# Altium project DemetrioGurgel - PCEIoT.PrjPcb (part 1 of 2)
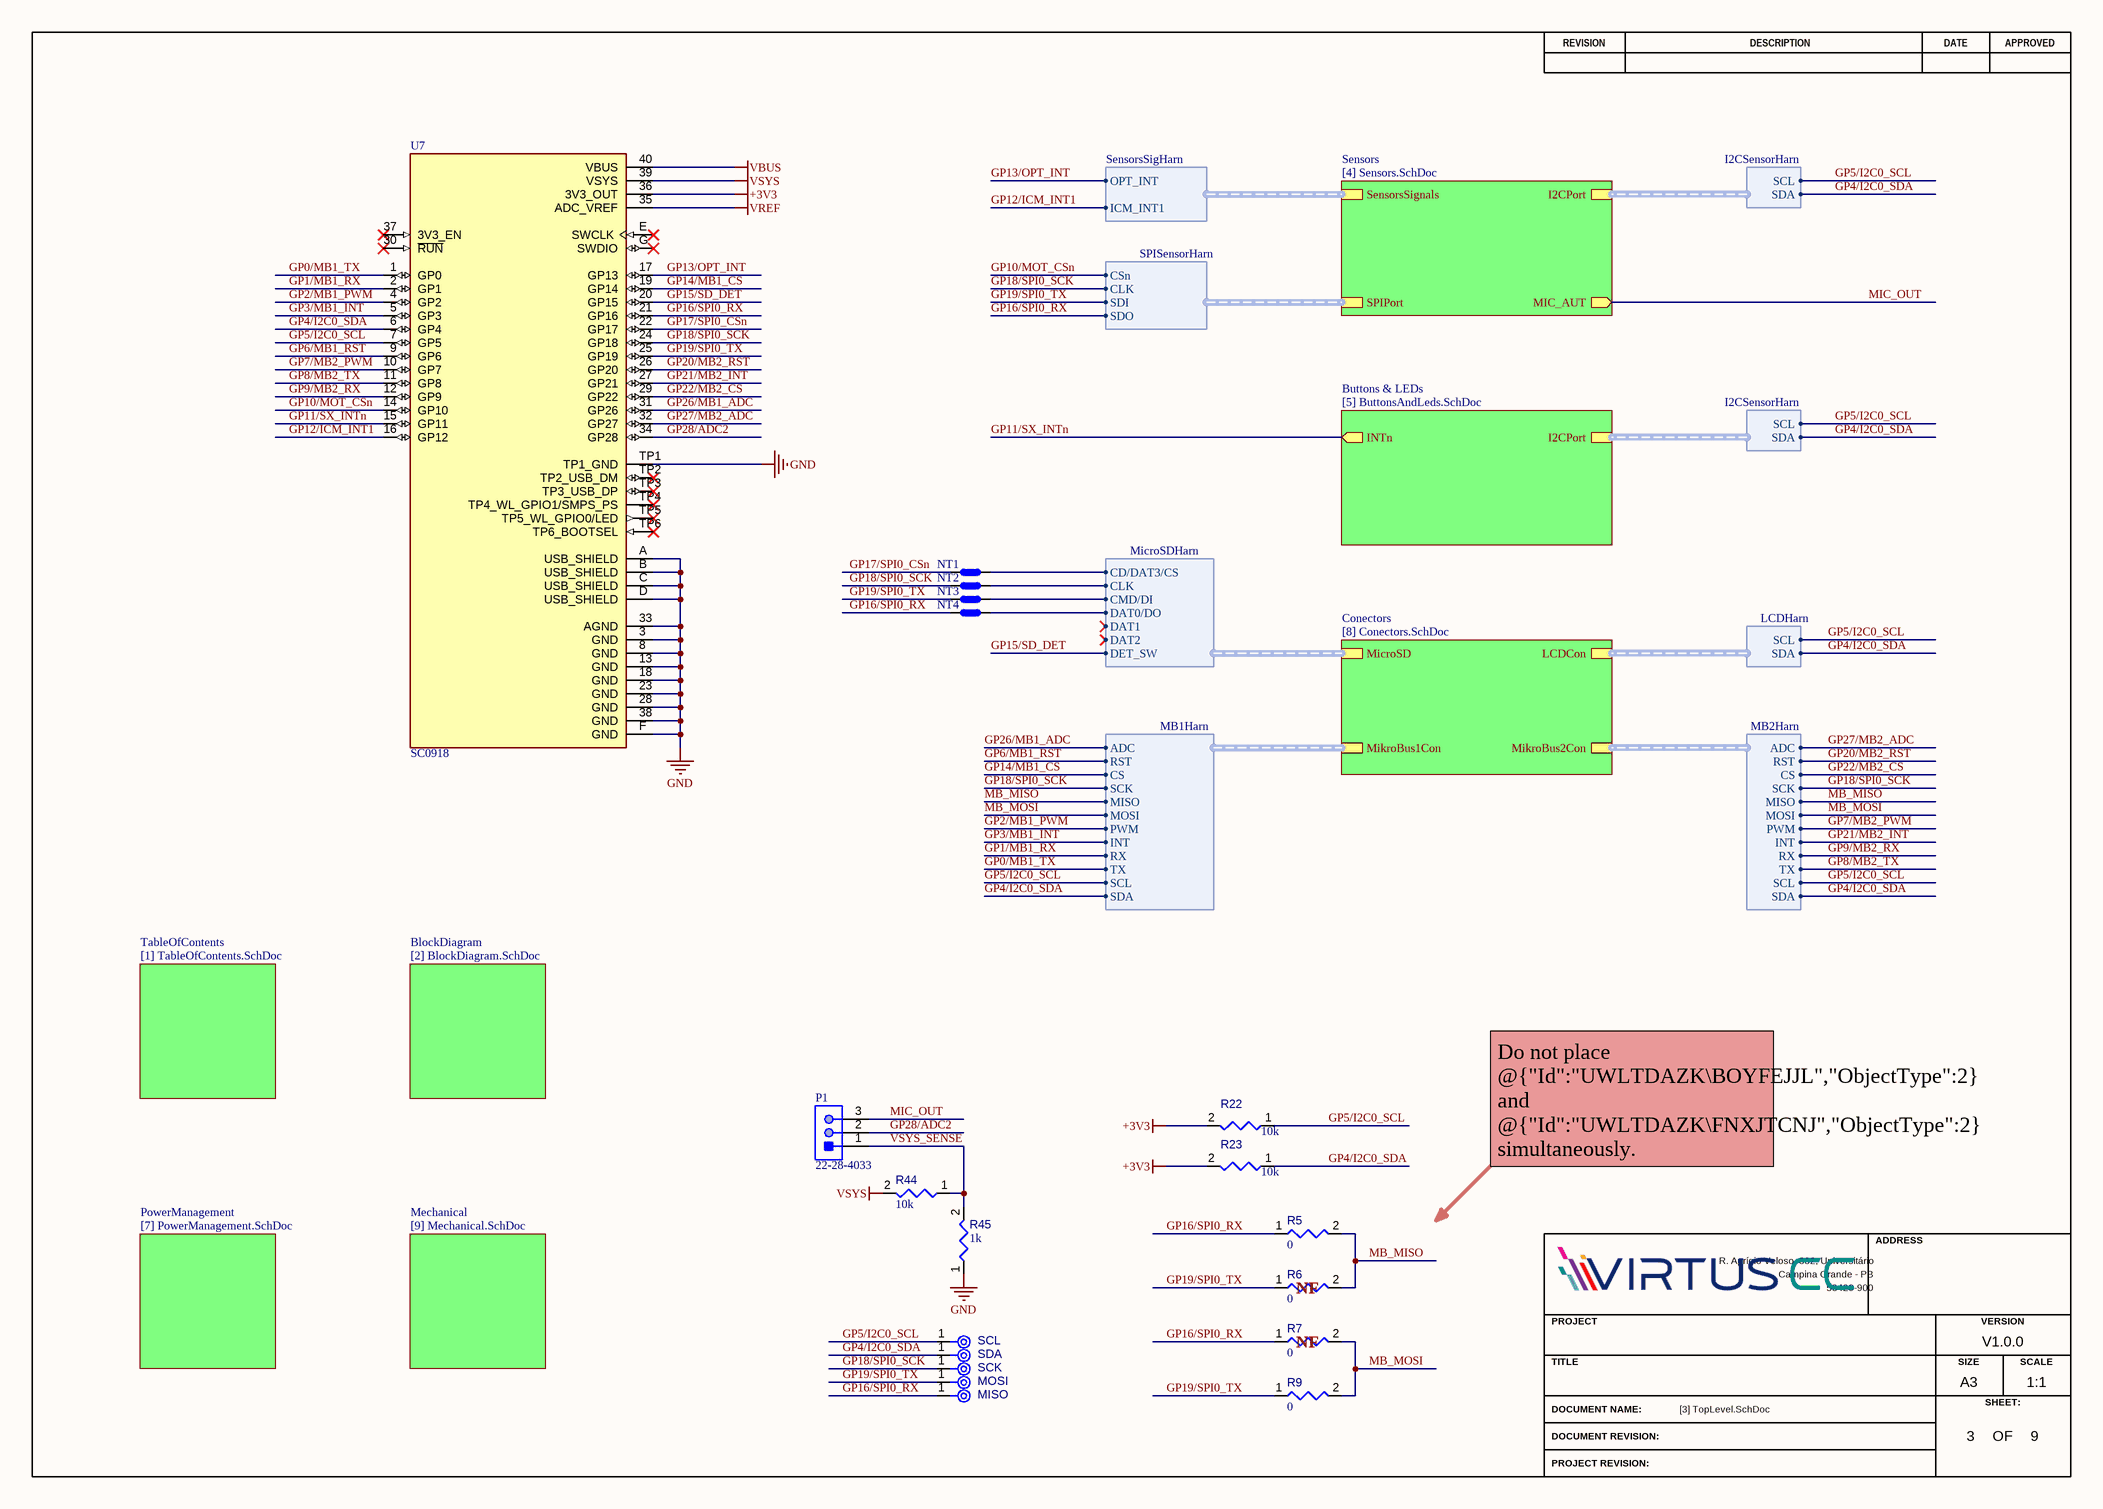
[diagram p0: [3] TopLevel.SchDoc]
Version: V1.0.0
9 sheets, 171 parts. Net scope: hierarchical (ports join the sheet entries above them; power ports are global).
Board file: DemetrioGurgel - PCEIoT.PcbDoc
Sheets:
  [3] TopLevel.SchDoc
    Buttons & LEDs = [5] ButtonsAndLeds.SchDoc
      "RGB_LEDs"1 = [6] RgbLed.SchDoc
      "RGB_LEDs"2 = [6] RgbLed.SchDoc
      "RGB_LEDs"3 = [6] RgbLed.SchDoc
    Conectors = [8] Conectors.SchDoc
    Sensors = [4] Sensors.SchDoc
    PowerManagement = [7] PowerManagement.SchDoc
    Mechanical = [9] Mechanical.SchDoc
    BlockDiagram = [2] BlockDiagram.SchDoc
    TableOfContents = [1] TableOfContents.SchDoc

## Sheet [3] TopLevel.SchDoc: =DocumentName
size A3; ENG_APP_DATE: --/--/--; DSN_APP_DATE: --/--/--; CHK_APP_DATE: --/--/--; Organization: ORGANIZATION; Address1: R. Aprígio Veloso, 882, Universitário; Address2: Campina Grande - PB; Address3: 58429-900; DocumentNumber: 3; Revision: -; SheetNumber: 3; SheetTotal: 9; Project: DemetrioGurgel - PCEIoT.PrjPcb; ENG_DATE: --/--/--; DSN_DATE: --/--/--; CHK_DATE: --/--/--; SCH_SCALE: 1:1

### Parts
MISO  TPAD6R  [TP06R]  (value not drawn)  (no BOM)
MOSI  TPAD6R  [TP06R]  (value not drawn)  (no BOM)
NT1  Net Tie  [New footprint 1]  (value not drawn)  (net tie, no BOM)
NT2  Net Tie  [New footprint 1]  (value not drawn)  (net tie, no BOM)
NT3  Net Tie  [New footprint 1]  (value not drawn)  (net tie, no BOM)
NT4  Net Tie  [New footprint 1]  (value not drawn)  (net tie, no BOM)
P1  22-28-4033  [MOLX-22-28-4033_V]
R5  value 0  [RESC0603(1608)_L]  (hidden comment: Resistor 0R +/- 5% 0603 100 mW)
R6  value 0  [RESC0603(1608)_L]  (hidden comment: Resistor 0R +/- 5% 0603 100 mW)
R7  value 0  [RESC0603(1608)_L]  (hidden comment: Resistor 0R +/- 5% 0603 100 mW)
R9  value 0  [RESC0603(1608)_L]  (hidden comment: Resistor 0R +/- 5% 0603 100 mW)
R22  value 10k  [RESC0603(1608)_L]  (hidden comment: Resistor 10k +/-1% 0603 100 mW)
R23  value 10k  [RESC0603(1608)_L]  (hidden comment: Resistor 10k +/-1% 0603 100 mW)
R44  value 10k  [RESC0603(1608)_L]  (hidden comment: Resistor 10k +/-1% 0603 100 mW)
R45  value 1k  [RESC0603(1608)_L]  (hidden comment: Resistor 1k +/-1% 0603 100 mW)
SCK  TPAD6R  [TP06R]  (value not drawn)  (no BOM)
SCL  TPAD6R  [TP06R]  (value not drawn)  (no BOM)
SDA  TPAD6R  [TP06R]  (value not drawn)  (no BOM)
U7  SC0918  [MODULE_SC0918]

### Sub-sheets
BlockDiagram = [2] BlockDiagram.SchDoc: no entries
Buttons & LEDs = [5] ButtonsAndLeds.SchDoc: INTn (out), I2CPort (harness I2CSensorHarn)
Conectors = [8] Conectors.SchDoc: MicroSD (harness MicroSDHarn), LCDCon (harness LCDHarn), MikroBus1Con (harness MB1Harn), MikroBus2Con (harness MB2Harn)
Mechanical = [9] Mechanical.SchDoc: no entries
PowerManagement = [7] PowerManagement.SchDoc: no entries
Sensors = [4] Sensors.SchDoc: I2CPort (harness I2CSensorHarn), SPIPort (harness SPISensorHarn), SensorsSignals (harness SensorsSigHarn), MIC_AUT (out)
TableOfContents = [1] TableOfContents.SchDoc: no entries

### Harnesses
MicroSDHarn: CD/DAT3/CS, CLK, CMD/DI, DAT0/DO, DAT1, DAT2, DET_SW
LCDHarn: SCL, SDA
SensorsSigHarn: OPT_INT, ICM_INT1
SPISensorHarn: CLK, CSn, SDI, SDO
I2CSensorHarn: SCL, SDA
MB1Harn: ADC, RST, CS, SCK, MISO, MOSI, PWM, INT, RX, TX, SCL, SDA
MB2Harn: ADC, RST, CS, SCK, MISO, MOSI, PWM, INT, RX, TX, SCL, SDA

### Nets
+3V3: R22.2 R23.2 U7.36(3V3_OUT)
GND: R45.1 U7.3(GND) U7.8(GND) U7.13(GND) U7.18(GND) U7.23(GND) U7.28(GND) U7.33(AGND) U7.38(GND) U7.A(USB_SHIELD) U7.B(USB_SHIELD) U7.C(USB_SHIELD) U7.D(USB_SHIELD) U7.F(GND) U7.TP1(TP1_GND)
VBUS: U7.40(VBUS)
VREF: U7.35(ADC_VREF)
VSYS: R44.2 U7.39(VSYS)
CLK: NT2.2 ; sheet Conectors/MicroSD.CLK
CS: NT1.2 ; sheet Conectors/MicroSD.CD/DAT3/CS
DI: NT3.2 ; sheet Conectors/MicroSD.CMD/DI
DO: NT4.2 ; sheet Conectors/MicroSD.DAT0/DO
GP0/MB1_TX: U7.1(GP0) ; sheet Conectors/MikroBus1Con.TX
GP1/MB1_RX: U7.2(GP1) ; sheet Conectors/MikroBus1Con.RX
GP2/MB1_PWM: U7.4(GP2) ; sheet Conectors/MikroBus1Con.PWM
GP3/MB1_INT: U7.5(GP3) ; sheet Conectors/MikroBus1Con.INT
GP4/I2C0_SDA: R23.1 SDA.1(TP) U7.6(GP4) ; sheet Conectors/LCDCon.SDA, sheet Sensors/I2CPort.SDA, sheet Buttons & LEDs/I2CPort.SDA, sheet Conectors/MikroBus1Con.SDA, sheet Conectors/MikroBus2Con.SDA
GP5/I2C0_SCL: R22.1 SCL.1(TP) U7.7(GP5) ; sheet Conectors/LCDCon.SCL, sheet Sensors/I2CPort.SCL, sheet Buttons & LEDs/I2CPort.SCL, sheet Conectors/MikroBus1Con.SCL, sheet Conectors/MikroBus2Con.SCL
GP6/MB1_RST: U7.9(GP6) ; sheet Conectors/MikroBus1Con.RST
GP7/MB2_PWM: U7.10(GP7) ; sheet Conectors/MikroBus2Con.PWM
GP8/MB2_TX: U7.11(GP8) ; sheet Conectors/MikroBus2Con.TX
GP9/MB2_RX: U7.12(GP9) ; sheet Conectors/MikroBus2Con.RX
GP10/MOT_CSn: U7.14(GP10) ; sheet Sensors/SPIPort.CSn
GP11/SX_INTn: U7.15(GP11) ; sheet Buttons & LEDs/INTn
GP12/ICM_INT1: U7.16(GP12) ; sheet Sensors/SensorsSignals.ICM_INT1
GP13/OPT_INT: U7.17(GP13) ; sheet Sensors/SensorsSignals.OPT_INT
GP14/MB1_CS: U7.19(GP14) ; sheet Conectors/MikroBus1Con.CS
GP15/SD_DET: U7.20(GP15) ; sheet Conectors/MicroSD.DET_SW  [project net DET_SW]
GP16/SPI0_RX: MISO.1(TP) NT4.1 R5.1 R7.1 U7.21(GP16) ; sheet Sensors/SPIPort.SDO
GP17/SPI0_CSn: NT1.1 U7.22(GP17)
GP18/SPI0_SCK: NT2.1 SCK.1(TP) U7.24(GP18) ; sheet Sensors/SPIPort.CLK, sheet Conectors/MikroBus1Con.SCK, sheet Conectors/MikroBus2Con.SCK
GP19/SPI0_TX: MOSI.1(TP) NT3.1 R6.1 R9.1 U7.25(GP19) ; sheet Sensors/SPIPort.SDI
GP20/MB2_RST: U7.26(GP20) ; sheet Conectors/MikroBus2Con.RST
GP21/MB2_INT: U7.27(GP21) ; sheet Conectors/MikroBus2Con.INT
GP22/MB2_CS: U7.29(GP22) ; sheet Conectors/MikroBus2Con.CS
GP26/MB1_ADC: U7.31(GP26) ; sheet Conectors/MikroBus1Con.ADC
GP27/MB2_ADC: U7.32(GP27) ; sheet Conectors/MikroBus2Con.ADC
GP28/ADC2: P1.2 U7.34(GP28)
MB_MISO: R5.2 R6.2 ; sheet Conectors/MikroBus1Con.MISO, sheet Conectors/MikroBus2Con.MISO  [project net MB1_MISO]
MB_MOSI: R7.2 R9.2 ; sheet Conectors/MikroBus1Con.MOSI, sheet Conectors/MikroBus2Con.MOSI  [project net MB1_MOSI]
MIC_OUT: P1.3 ; sheet Sensors/MIC_AUT
VSYS_SENSE: P1.1 R44.1 R45.2

Not connected (* = marked no-connect by the designer): U7 30(~{RUN})* 37(3V3_EN)* E(SWCLK)* G(SWDIO)* TP2(TP2_USB_DM)* TP3(TP3_USB_DP)* TP4(TP4_WL_GPIO1/SMPS_PS)* TP5(TP5_WL_GPIO0/LED)* TP6(TP6_BOOTSEL)*

### Notes on the sheet
- Do not place @{"Id":"UWLTDAZK\BOYFEJJL","ObjectType":2} and @{"Id":"UWLTDAZK\FNXJTCNJ","ObjectType":2} simultaneously.
  Do not place @{"Id":"UWLTDAZK\CHTEIYBT","ObjectType":2} and @{"Id":"IOCENJZE\NTQAKYMT","ObjectType":2} simultaneously.
- (near R6) NF
- (near R7) NF
- REVISION
- DESCRIPTION
- DATE
- APPROVED
- ADDRESS
- PROJECT
- VERSION
- TITLE
- A3
- SIZE
- SCALE
- DOCUMENT NAME:
- DOCUMENT REVISION:
- OF
- SHEET:
- PROJECT REVISION:

### Library data of the parts
MISO MOSI SCK SCL SDA = CMP-00028-00002-2: 0.6mm round; Pins: 1
NT1-NT4 = CMP-001-0003-6: Net Tie 0.3mm
P1 = CMP-002-00076-1: KK 254 Breakaway Header Vertical 3 Circuits 0.38um Gold Selective Plating Mating Pin 6.09mm; Pitch: 2.54mm; Number of Positions: 3; Contact Resistance: 20mR; Max Voltage Rating (AC): 250V; Current Rating: 4A; Gender: Male; Glow Wire Compliant: Non-compliant; RoHS Compliant: Yes; Contact Plating: Gold; Housing Color: Black; Housing Material: Nylon; Contact Mating Length: 0.24inch; Depth: 2.49mm; Number of Circuits: 3; Reach SVHC Compliant: Unknown; Packaging: Bulk; Max Voltage Rating (DC): 250V; Number of Rows: 1; Color: Black; Package Quantity: 1; Orientation: Straight; Number of Contacts: 3; Max Operating Temperature: 75°C; Mounting Technology: Through Hole; Min Operating Temperature: 0°C; Termination: Solder; Radiation Hardening: No; Series: KK® 42375; Contact Material: Brass,Bronze; Flammability Rating: UL94 V-0; Lead Free: Lead Free; Contact Type: Male Pin; Voltage Rating: 250V; Voltage Rating (DC): 250V
R5-R7 R9 = CMP-009-00006-6: Chip Resistor, 0 Ohm, 0.1 W, -55 to 155 degC, 0603 (1608 Metric); Power: 100mW; Voltage Rating: 50V; Tolerance: 5%; Mounting Technology: SM; RoHS Compliant: True; Max Operating Temperature: 155°C; Min Operating Temperature: -55°C; Case/Package: 0603; Pins: 2
R22 R23 R44 = CMP-009-00017-7: Chip Resistor, 10 KOhm, +/- 1%, 01 W, -55 to 155 degC, 0603 (1608 Metric); Voltage Rating: 50V; Power: 100mW; RoHS Compliant: True; Min Operating Temperature: -55°C; Pins: 2; Case/Package: 0603; Mounting Technology: SM; Max Operating Temperature: 155°C; Tolerance: 1%
R45 = CMP-009-00014-6: Chip Resistor, 1 KOhm, +/-1%, 0.1 W, -55 to 155 degC, 0603 (1608 Metric); Power: 100mW; Tolerance: 1%; Voltage Rating: 50V; Mounting Technology: SM; Case/Package: 0603; Min Operating Temperature: -55°C; RoHS Compliant: True; Max Operating Temperature: 155°C; Pins: 2
U7 = CMP-006-000001-6: Raspberry Pi Pico W RP2040; Pin Count: 53; MP: SC0918; Availability: In Stock; Source: SC0918.SchLib; Purchase-URL: https://pricing.snapeda.com/search/part/SC0918/?ref=eda; Price: None; MF: Raspberry Pi; Component Type: Standard; Design Item ID: SC0918; SnapEDA_Link: https://www.snapeda.com/parts/SC0918/Raspberry+Pi/view-part/?ref=snap; Check_prices: https://www.snapeda.com/parts/SC0918/Raspberry+Pi/view-part/?ref=eda; Value: *; Package: None

## Sheet [5] ButtonsAndLeds.SchDoc: =DocumentName
size A3; ENG_APP_DATE: --/--/--; DSN_APP_DATE: --/--/--; CHK_APP_DATE: --/--/--; Organization: ORGANIZATION; Address1: R. Aprígio Veloso, 882, Universitário; Address2: Campina Grande - PB; Address3: 58429-900; DocumentNumber: 5; Revision: -; SheetNumber: 5; SheetTotal: 9; Project: DemetrioGurgel - PCEIoT.PrjPcb; ENG_DATE: --/--/--; DSN_DATE: --/--/--; CHK_DATE: --/--/--; SCH_SCALE: 1:1
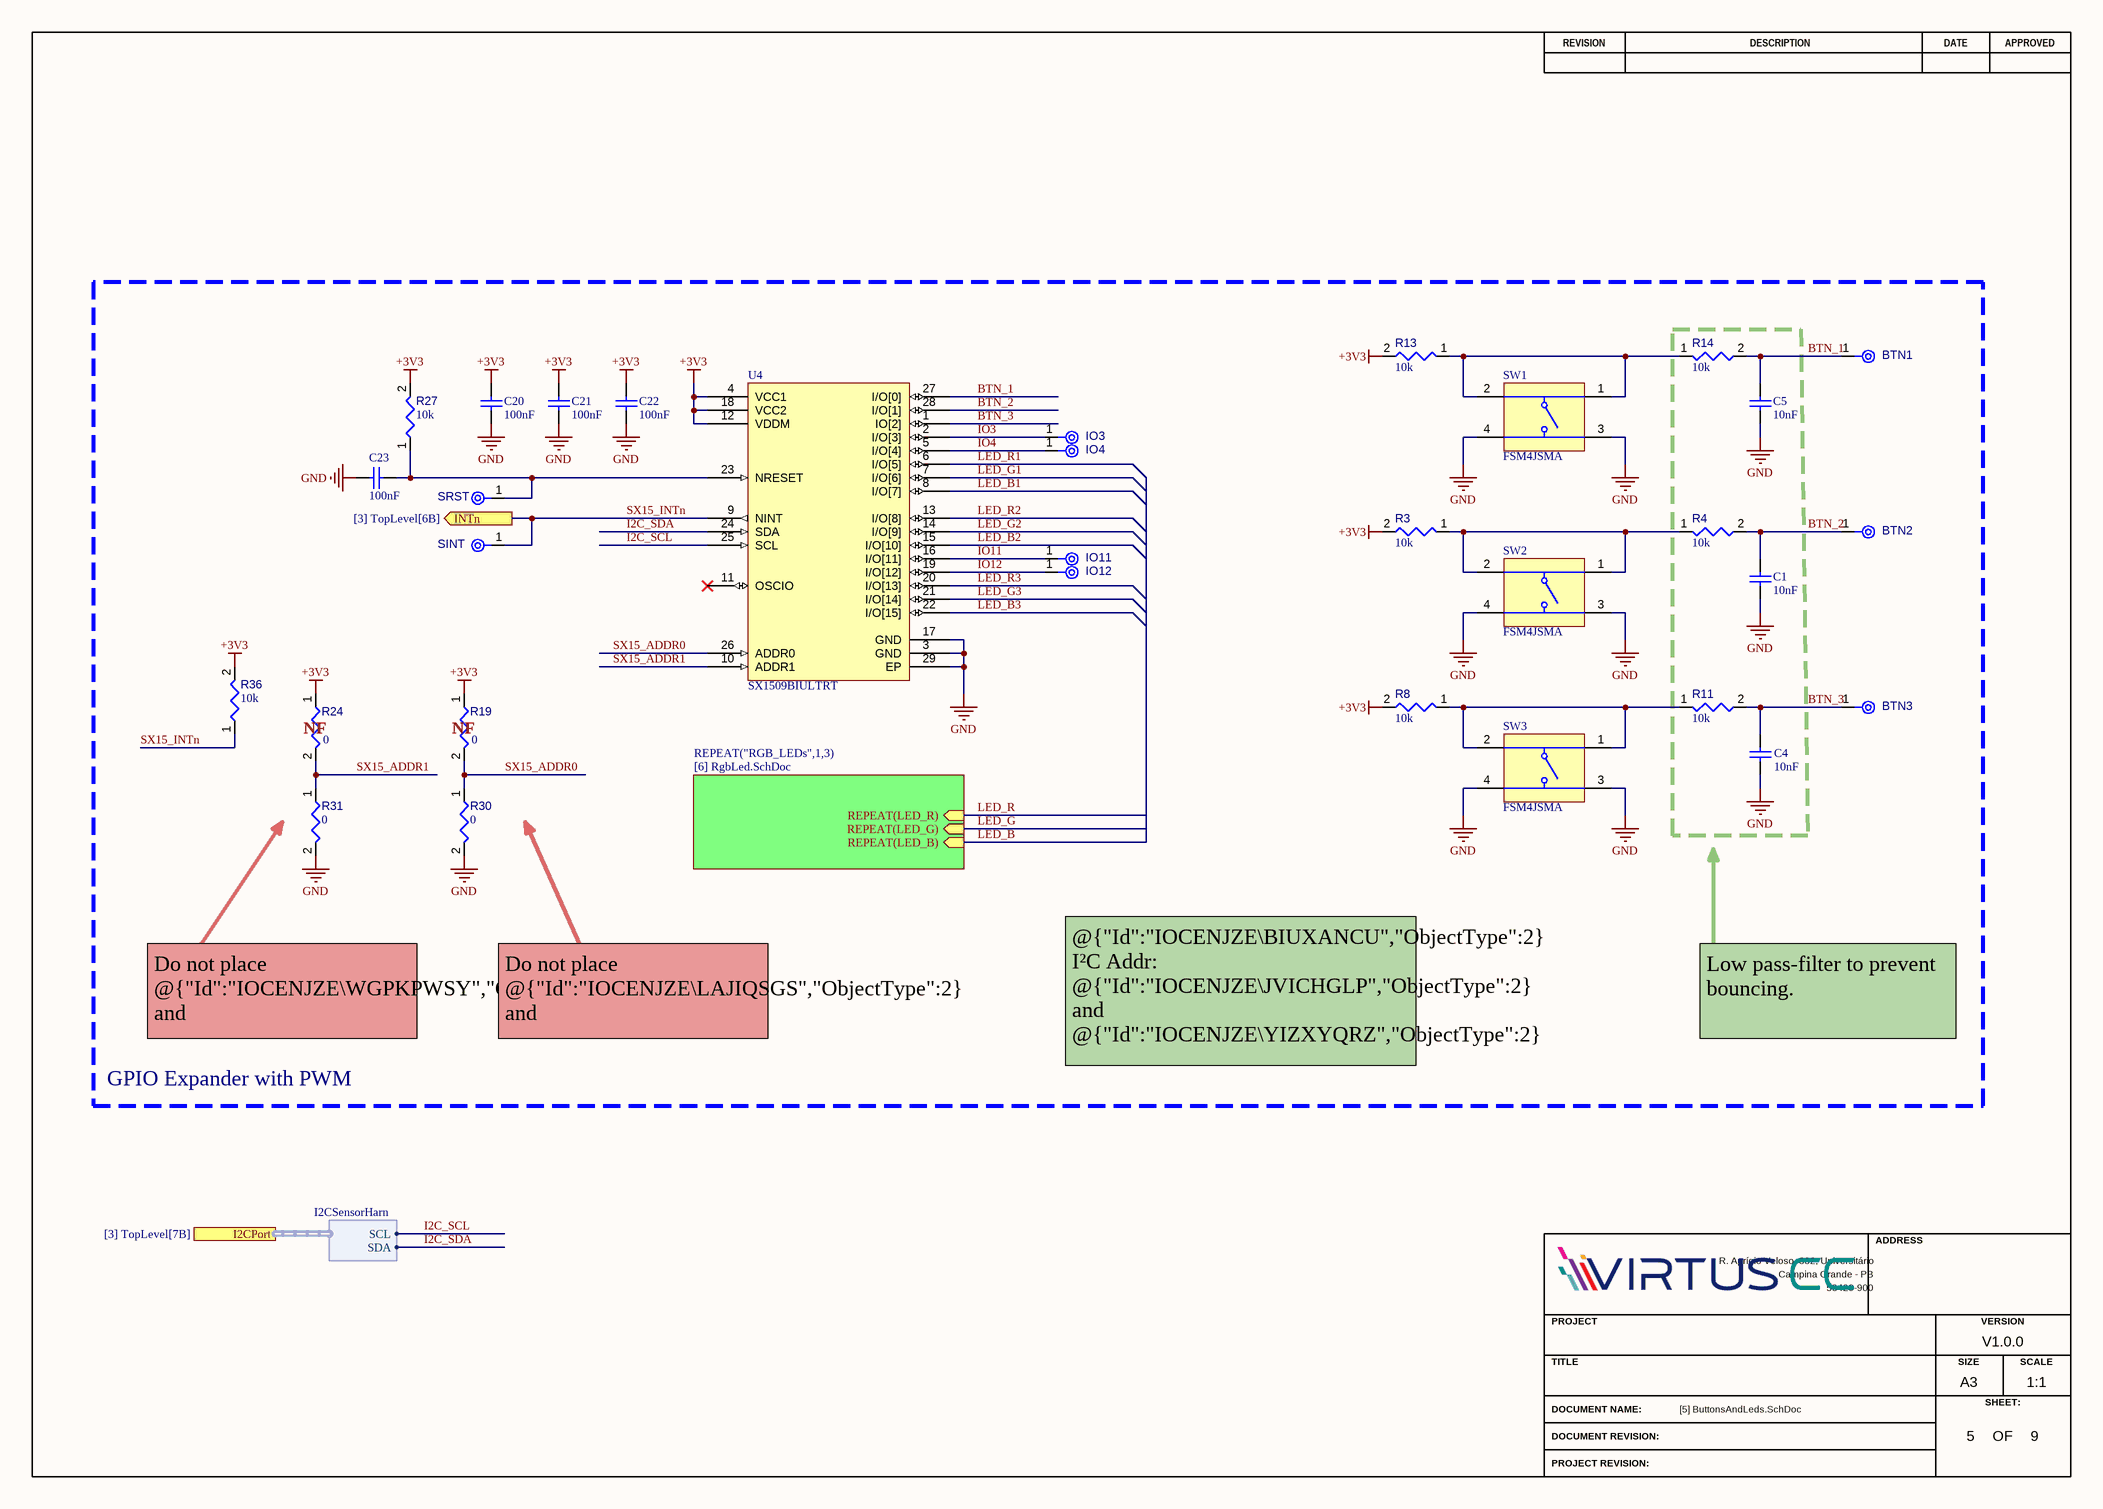
[diagram p1: [5] ButtonsAndLeds.SchDoc]

### Parts
BTN1  TPAD6R  [TP06R]  (value not drawn)  (no BOM)
BTN2  TPAD6R  [TP06R]  (value not drawn)  (no BOM)
BTN3  TPAD6R  [TP06R]  (value not drawn)  (no BOM)
C1  value 10nF  [CAPC0603(1608)100_L]  (hidden comment: VJ0603Y103KXAAC)
C4  value 10nF  [CAPC0603(1608)100_L]  (hidden comment: VJ0603Y103KXAAC)
C5  value 10nF  [CAPC0603(1608)100_L]  (hidden comment: VJ0603Y103KXAAC)
C20  value 100nF  [CAPC0603(1608)100_L]  (hidden comment: VJ0603Y104MXJCW1BC)
C21  value 100nF  [CAPC0603(1608)100_L]  (hidden comment: VJ0603Y104MXJCW1BC)
C22  value 100nF  [CAPC0603(1608)100_L]  (hidden comment: VJ0603Y104MXJCW1BC)
C23  value 100nF  [CAPC0603(1608)100_L]  (hidden comment: VJ0603Y104MXJCW1BC)
IO3  TPAD6R  [TP06R]  (value not drawn)  (no BOM)
IO4  TPAD6R  [TP06R]  (value not drawn)  (no BOM)
IO11  TPAD6R  [TP06R]  (value not drawn)  (no BOM)
IO12  TPAD6R  [TP06R]  (value not drawn)  (no BOM)
R3  value 10k  [RESC0603(1608)_L]  (hidden comment: Resistor 10k +/-1% 0603 100 mW)
R4  value 10k  [RESC0603(1608)_L]  (hidden comment: Resistor 10k +/-1% 0603 100 mW)
R8  value 10k  [RESC0603(1608)_L]  (hidden comment: Resistor 10k +/-1% 0603 100 mW)
R11  value 10k  [RESC0603(1608)_L]  (hidden comment: Resistor 10k +/-1% 0603 100 mW)
R13  value 10k  [RESC0603(1608)_L]  (hidden comment: Resistor 10k +/-1% 0603 100 mW)
R14  value 10k  [RESC0603(1608)_L]  (hidden comment: Resistor 10k +/-1% 0603 100 mW)
R19  value 0  [RESC0603(1608)_L]  (hidden comment: Resistor 0R +/- 5% 0603 100 mW)
R24  value 0  [RESC0603(1608)_L]  (hidden comment: Resistor 0R +/- 5% 0603 100 mW)
R27  value 10k  [RESC0603(1608)_L]  (hidden comment: Resistor 10k +/-1% 0603 100 mW)
R30  value 0  [RESC0603(1608)_L]  (hidden comment: Resistor 0R +/- 5% 0603 100 mW)
R31  value 0  [RESC0603(1608)_L]  (hidden comment: Resistor 0R +/- 5% 0603 100 mW)
R36  value 10k  [RESC0603(1608)_L]  (hidden comment: Resistor 10k +/-1% 0603 100 mW)
SINT  TPAD6R  [TP06R]  (value not drawn)  (no BOM)
SRST  TPAD6R  [TP06R]  (value not drawn)  (no BOM)
SW1  FSM4JSMA  [TECO-FSM4JSMA_V]
SW2  FSM4JSMA  [TECO-FSM4JSMA_V]
SW3  FSM4JSMA  [TECO-FSM4JSMA_V]
U4  SX1509BIULTRT  [QFN40P410X410X60_HS-29N]

### Sub-sheets
REPEAT("RGB_LEDs",1,3) = [6] RgbLed.SchDoc: REPEAT(LED_R) (in), REPEAT(LED_G) (in), REPEAT(LED_B) (in)

### Ports
I2CPort (harness I2CSensorHarn, see [3] TopLevel[7B]), INTn (out, see [3] TopLevel[6B])

### Harnesses
I2CSensorHarn: SCL, SDA

### Nets
+3V3: C20.1 C21.1 C22.1 R3.2 R8.2 R13.2 R19.1 R24.1 R27.2 R36.2 U4.4(VCC1) U4.12(VDDM) U4.18(VCC2)
GND: C1.1 C4.1 C5.1 C20.2 C21.2 C22.2 C23.2 R30.2 R31.2 SW1.3 SW1.4 SW2.3 SW2.4 SW3.3 SW3.4 U4.3(GND) U4.17(GND) U4.29(EP)
BTN_1: BTN1.1(TP) C5.2 R14.2 U4.27(I/O[0])
BTN_2: BTN2.1(TP) C1.2 R4.2 U4.28(I/O[1])
BTN_3: BTN3.1(TP) C4.2 R11.2 U4.1(IO[2])
I2C_SCL: U4.25(SCL) ; port I2CPort.SCL  [project net GP5/I2C0_SCL]
I2C_SDA: U4.24(SDA) ; port I2CPort.SDA  [project net GP4/I2C0_SDA]
IO3: IO3.1(TP) U4.2(I/O[3])
IO4: IO4.1(TP) U4.5(I/O[4])
IO11: IO11.1(TP) U4.16(I/O[11])
IO12: IO12.1(TP) U4.19(I/O[12])
LED_B: sheet REPEAT("RGB_LEDs",1,3)/REPEAT(LED_B)
LED_B1: U4.8(I/O[7])  [project net LED_B]
LED_B2: U4.15(I/O[10])  [project net LED_B]
LED_B3: U4.22(I/O[15])  [project net LED_B]
LED_G: sheet REPEAT("RGB_LEDs",1,3)/REPEAT(LED_G)
LED_G1: U4.7(I/O[6])  [project net LED_G]
LED_G2: U4.14(I/O[9])  [project net LED_G]
LED_G3: U4.21(I/O[14])  [project net LED_G]
LED_R: sheet REPEAT("RGB_LEDs",1,3)/REPEAT(LED_R)
LED_R1: U4.6(I/O[5])  [project net LED_R]
LED_R2: U4.13(I/O[8])  [project net LED_R]
LED_R3: U4.20(I/O[13])  [project net LED_R]
SX15_ADDR0: R19.2 R30.1 U4.26(ADDR0)
SX15_ADDR1: R24.2 R31.1 U4.10(ADDR1)
SX15_INTn: R36.1 SINT.1(TP) U4.9(NINT) ; port INTn  [project net GP11/SX_INTn]
NetC23_1: C23.1 R27.1 SRST.1(TP) U4.23(NRESET)
NetR3_1: R3.1 R4.1 SW2.1 SW2.2
NetR8_1: R8.1 R11.1 SW3.1 SW3.2
NetR13_1: R13.1 R14.1 SW1.1 SW1.2

Not connected (* = marked no-connect by the designer): U4 11(OSCIO)*

### Notes on the sheet
- (near R24) NF
- (near R19) NF
- Do not place @{"Id":"IOCENJZE\WGPKPWSY","ObjectType":2} and @{"Id":"IOCENJZE\JVICHGLP","ObjectType":2} simultaneously.
- Do not place @{"Id":"IOCENJZE\LAJIQSGS","ObjectType":2} and @{"Id":"IOCENJZE\YIZXYQRZ","ObjectType":2} simultaneously.
- Low pass-filter to prevent bouncing.
- GPIO Expander with PWM
- @{"Id":"IOCENJZE\BIUXANCU","ObjectType":2}  I²C Addr:
  @{"Id":"IOCENJZE\JVICHGLP","ObjectType":2} and @{"Id":"IOCENJZE\YIZXYQRZ","ObjectType":2} placed: 0x3E
  @{"Id":"IOCENJZE\JVICHGLP","ObjectType":2} and @{"Id":"IOCENJZE\LAJIQSGS","ObjectType":2} placed: 0x3F
  @{"Id":"IOCENJZE\WGPKPWSY","ObjectType":2} and @{"Id":"IOCENJZE\YIZXYQRZ","ObjectType":2} placed: 0x70
  @{"Id":"IOCENJZE\WGPKPWSY","ObjectType":2} and @{"Id":"IOCENJZE\LAJIQSGS","ObjectType":2} placed: 0x71
- REVISION
- DESCRIPTION
- DATE
- APPROVED
- ADDRESS
- PROJECT
- VERSION
- TITLE
- A3
- SIZE
- SCALE
- DOCUMENT NAME:
- DOCUMENT REVISION:
- OF
- SHEET:
- PROJECT REVISION:

### Library data of the parts
BTN1-BTN3 IO3 IO4 IO11 IO12 SINT SRST = CMP-00028-00002-2: 0.6mm round; Pins: 1
C1 C4 C5 = CMP-001-00084-1: Multilayer Ceramic Capacitor, 0.01 uF, 50 V, ± 10%, X7R, 0603 [1608 Metric]; Voltage Rating: 50V; Height: 0.92mm; Voltage Rating (DC): 50V; Depth: 0.8mm; Case Code (Imperial): 0603; Packaging: Tape and Reel; Length: 1.6mm; Max Operating Temperature: 125°C; Min Operating Temperature: -55°C; Case/Package: 0603; Pins: 2; Series: VJ; Thickness: 0.036inch; Weight: 7.1E-05oz; Reach SVHC Compliant: Unknown; Termination: SMD/SMT; Package Quantity: 1; RoHS Compliant: Yes; Mounting Technology: Surface Mount; Construction: Flat; Voltage: 50V; Lead Free: Lead Free; Width: 0.031inch; Case Code (Metric): 1608; Tolerance: 10%; Dielectric: X7R
C20-C23 = CMP-001-00085-1: Multilayer Ceramic Capacitor, 0.1 uF, 16 V, ± 20%, X7R, 0603 [1608 Metric]; Dielectric Material: Tantalum; Voltage Rating: 16V; Packaging: Tape and Reel; Min Operating Temperature: -55°C; Case/Package: 0603; Length: 1.6mm; Termination: SMD/SMT; Height: 0.95mm; Mounting Technology: Surface Mount; Width: 0.8mm; Case Code (Imperial): 0603; Construction: Flat; Lead Free: Lead Free; Package Quantity: 4000; Max Operating Temperature: 125°C; Dielectric: X7R; RoHS Compliant: Yes; Depth: 0.8mm; Tolerance: 20%; Series: VJ; Case Code (Metric): 1608; Voltage Rating (DC): 16V
R3 R4 R8 R11 R13 R14 R27 R36 = CMP-009-00017-7: as R22 on sheet [3] TopLevel; RoHS Compliant: True; Min Operating Temperature: -55°C; Pins: 2; Case/Package: 0603; Mounting Technology: SM; Max Operating Temperature: 155°C; Tolerance: 1%
R19 R24 R30 R31 = CMP-009-00006-6: as R5 on sheet [3] TopLevel; Tolerance: 5%; Mounting Technology: SM; RoHS Compliant: True; Max Operating Temperature: 155°C; Min Operating Temperature: -55°C; Case/Package: 0603; Pins: 2
SW1-SW3 = CMP-011-00013-1: Switch Tactile OFF (ON) SPST Round Button Gull Wing 0.05A 12VDC 1.57N SMD Loose Piece; Switch Travel: 0.25mm; Mechanical Life: 100000Cycles; Contact Current Rating: 50mA; Actuator Material: Polyphenylene; Voltage Rating: 24V; Illumination Type: Non-Illuminated,Illuminated; Actuator Length: 1.4mm; Actuator Type: Standard; Switch Function: Off-Mom; Insulation Resistance: 100MR; Orientation: Straight; Min Operating Temperature: -35°C; Packaging: Bulk; Termination: Gull Wing; Throw Configuration: SPST; Mounting Technology: Surface Mount; Operating Force: 1.57N; Contact Plating: Silver; Max Operating Temperature: 85°C; Length: 6mm; Voltage Rating (DC): 24V; Current Rating: 50mA; Package Quantity: 750; Width: 6mm; Contact Material: Copper Alloy,Silver; Max Current Rating: 50mA; Depth: 10mm; Series: FSMJSMA; ELV: Compliant; Case/Package: SMD/SMT; Color: Black; Reach SVHC Compliant: Unknown; RoHS Compliant: Yes; Lead Free: Lead Free
U4 = CMP-016-00011-5: IC Gpio Expander I2C 16CH 28QFN / I2C Interface 5.5V 28-PIN Qfn-ut Ep T/r; Frequency: 400kHz; Number of I/Os: 16; Lead Free: Lead Free; Series: -; RoHS Compliant: Yes; Interface: I2C; Min Operating Temperature: -40°C; Pins: 28; Mounting Technology: Surface Mount; Case/Package: QFN; Max Operating Temperature: 85°C; Packaging: Cut Tape

## Sheet [6] RgbLed.SchDoc: =DocumentName
size A3; ENG_APP_DATE: --/--/--; DSN_APP_DATE: --/--/--; CHK_APP_DATE: --/--/--; Organization: ORGANIZATION; Address1: R. Aprígio Veloso, 882, Universitário; Address2: Campina Grande - PB; Address3: 58429-900; DocumentNumber: 6; Revision: -; SheetNumber: 6; SheetTotal: 9; Project: DemetrioGurgel - PCEIoT.PrjPcb; ENG_DATE: --/--/--; DSN_DATE: --/--/--; CHK_DATE: --/--/--; SCH_SCALE: 1:1
Used 3 times, as channels Buttons & LEDs/"RGB_LEDs"1, Buttons & LEDs/"RGB_LEDs"2, Buttons & LEDs/"RGB_LEDs"3. Parts and nets are listed once, with the designators drawn on the sheet.
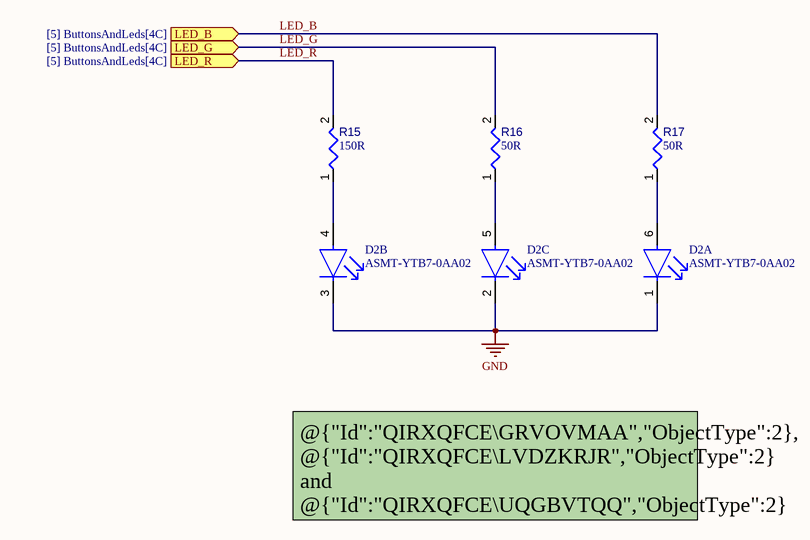
[diagram p2: [6] RgbLed.SchDoc]

### Parts
D2  ASMT-YTB7-0AA02  [FP-PLCC-6-MFG]  (parts A,B,C of 3)
R15  value 150R  [RESC0603(1608)_L]  (hidden comment: CRCW0603150RFKEA)
R16  value 50R  [RESC0603(1608)_L]  (hidden comment: CRCW060350R0FKEA)
R17  value 50R  [RESC0603(1608)_L]  (hidden comment: CRCW060350R0FKEA)

### Ports
LED_B (in, see [5] ButtonsAndLeds[4C]), LED_G (in, see [5] ButtonsAndLeds[4C]), LED_R (in, see [5] ButtonsAndLeds[4C])

### Nets
GND: D2.1(Cathode(Blue)) D2.2(Cathode(Green)) D2.3(Cathode(Red))
LED_B: R17.2 ; port LED_B
LED_G: R16.2 ; port LED_G
LED_R: R15.2 ; port LED_R
NetD2_4: D2.4(Anode(Red)) R15.1
NetD2_5: D2.5(Anode(Green)) R16.1
NetD2_6: D2.6(Anode(Blue)) R17.1

### Channels
Buttons & LEDs/"RGB_LEDs"1: designators end in A; ports LED_B=LED_B LED_G=LED_G LED_R=LED_R
Buttons & LEDs/"RGB_LEDs"2: designators end in B; ports LED_B=LED_B LED_G=LED_G LED_R=LED_R
Buttons & LEDs/"RGB_LEDs"3: designators end in C; ports LED_B=LED_B LED_G=LED_G LED_R=LED_R

### Notes on the sheet
- @{"Id":"QIRXQFCE\GRVOVMAA","ObjectType":2}, @{"Id":"QIRXQFCE\LVDZKRJR","ObjectType":2} and @{"Id":"QIRXQFCE\UQGBVTQQ","ObjectType":2} calculated based on voltage drops for each LED for a same current amount of 10mA.
- REVISION
- DESCRIPTION
- DATE
- APPROVED
- ADDRESS
- PROJECT
- VERSION
- TITLE
- A3
- SIZE
- SCALE
- DOCUMENT NAME:
- DOCUMENT REVISION:
- OF
- SHEET:
- PROJECT REVISION:

### Library data of the parts
D2 = CMP-007-00036-1: LED Tri-Color Blue/Green/Red 469nm/529nm/623nm Chip LED 6-Pin PLCC T/R; Forward Voltage: 3.1V; Test Current: 20mA; Number of LEDs: 3; Lens Transparency: Diffused; Luminous Intensity: 384mcd; Viewing Angle: 120°; Color: Blue,Green,Red; Reverse Voltage: 4V; Dominant Wavelength: 469nm; Lens Style: Flat,Square,Diffused,Rectangular; Lens Size: 2.3mm; Packaging: Cut Tape; Min Operating Temperature: -40°C; Weight: 40mg; Forward Current: 20mA; Orientation: Top View; Package Quantity: 2000; Case/Package: PLCC; Length: 3mm; Height: 2mm; Max Operating Temperature: 100°C; Contact Plating: Silver; Width: 2.8mm; Reach SVHC Compliant: No; Pins: 6; Series: -; Mounting Technology: Surface Mount
R15 = CMP-009-00179-1: SMD Chip Resistor, 150 Ohm, ± 1%, 100 mW, 0603 [1608 Metric], Thick Film, General Purpose; Voltage Rating (DC): 75V; Power Rating: 100mW; Temperature Coefficient: 100ppm/°C; Reach SVHC Compliant: Unknown; Height: 0.45mm; Package Quantity: 5000; Technology: THICK FILM; Case Code (Metric): 1608; Weight: 7.1E-05oz; Tolerance: 1%; Max Operating Temperature: 155°C; Military Standard: Not; Series: CRCW; Contact Plating: Tin; Number of Terminations: 2; Ratings: AEC-Q200; Features: Automotive AEC-Q200; Packaging: Tape and Reel; Resistor Type: Thick Film; Construction: Rectangular; Lead Free: Lead Free; Termination: SMD/SMT; Min Operating Temperature: -55°C; Max Power Dissipation: 100mW; Voltage Rating: 75V; Case/Package: 0603; Depth: 0.85mm; Width: 0.85mm; Radiation Hardening: No; Length: 1.55mm; Case Code (Imperial): 0603; RoHS Compliant: Yes; Resistance Tolerance: 1%
R16 R17 = CMP-009-00180-1: SMD Chip Resistor, 50 Ohm, ± 1%, 100 mW, 0603 [1608 Metric], Thick Film, General Purpose; Voltage Rating (DC): 75V; Temperature Coefficient: 100ppm/°C; Max Power Dissipation: 100mW; Termination: SMD/SMT; Height: 0.45mm; Features: Automotive AEC-Q200; Package Quantity: 5000; Max Operating Temperature: 155°C; Pins: 2; Resistance Tolerance: 1%; Depth: 0.85mm; Width: 0.85mm; Contact Plating: Tin; RoHS Compliant: Yes; Case Code (Metric): 1608; Length: 1.55mm; Radiation Hardening: No; Resistor Type: Thick Film; Min Operating Temperature: -55°C; Tolerance: 1%; Reach SVHC Compliant: No; Number of Terminations: 2; Weight: 7.1E-05oz; Packaging: Tape and Reel; Power Rating: 100mW; Case Code (Imperial): 0603; Technology: THICK FILM; Voltage Rating: 75V; Lead Free: Lead Free; Series: CRCW; Case/Package: 0603

## Sheet [8] Conectors.SchDoc: =DocumentName
size A3; ENG_APP_DATE: --/--/--; DSN_APP_DATE: --/--/--; CHK_APP_DATE: --/--/--; Organization: ORGANIZATION; Address1: R. Aprígio Veloso, 882, Universitário; Address2: Campina Grande - PB; Address3: 58429-900; DocumentNumber: 8; Revision: -; SheetNumber: 8; SheetTotal: 9; Project: DemetrioGurgel - PCEIoT.PrjPcb; ENG_DATE: --/--/--; DSN_DATE: --/--/--; CHK_DATE: --/--/--; SCH_SCALE: 1:1
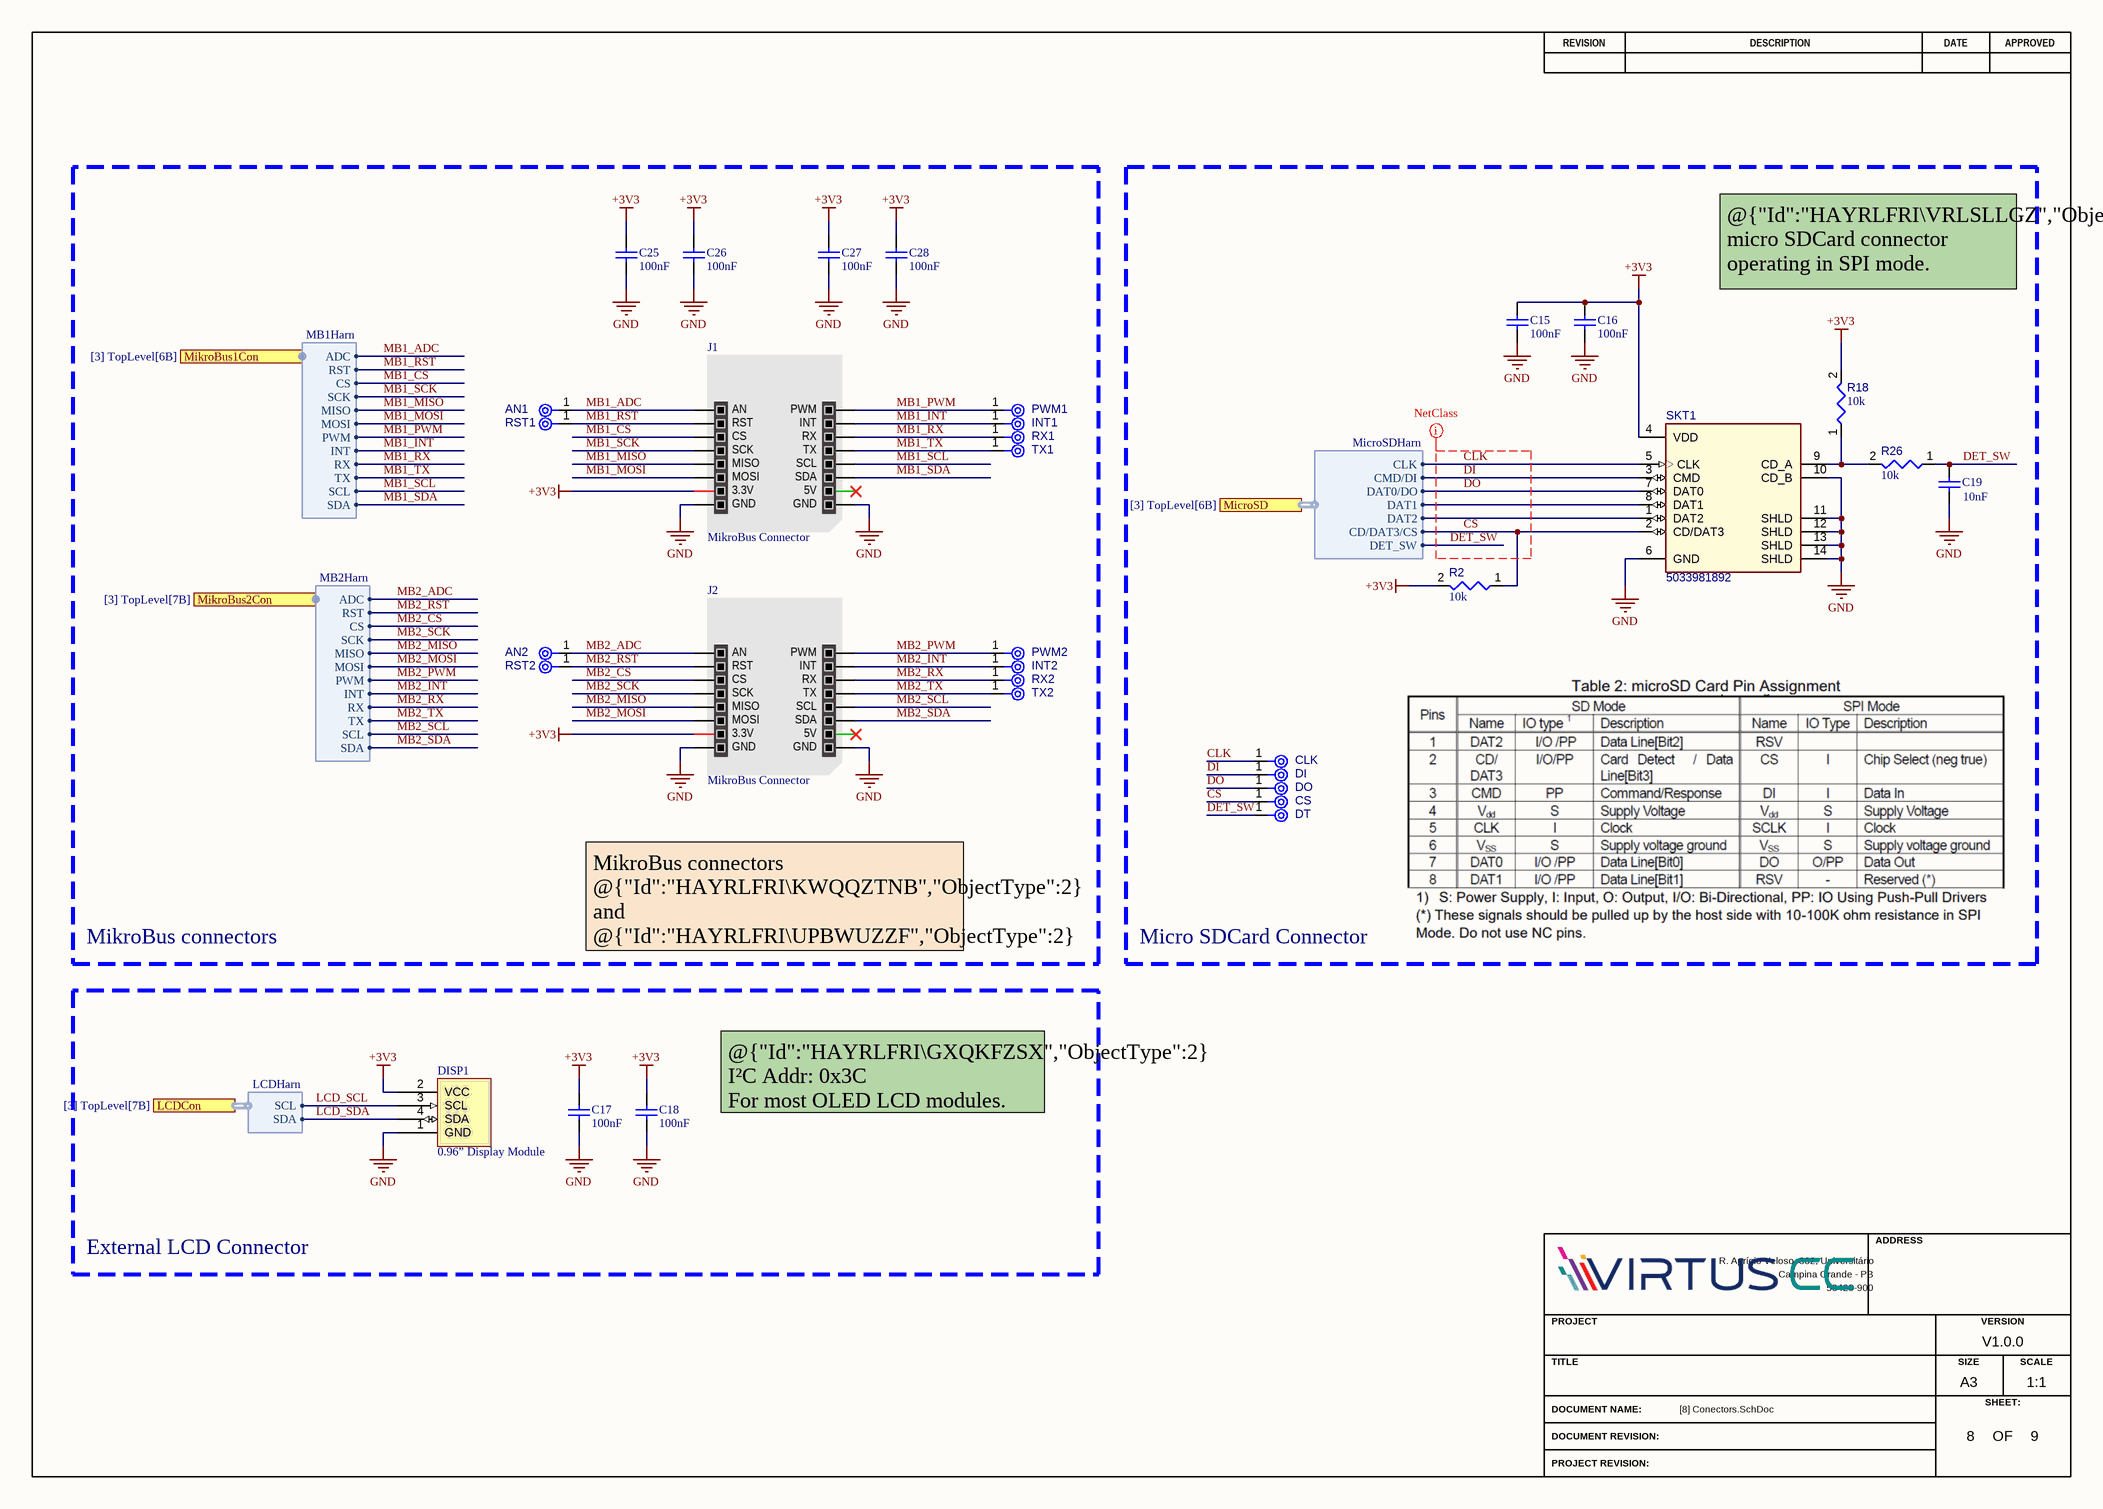
[diagram p3: [8] Conectors.SchDoc]

### Parts
AN1  TPAD6R  [TP06R]  (value not drawn)  (no BOM)
AN2  TPAD6R  [TP06R]  (value not drawn)  (no BOM)
C15  value 100nF  [CAPC0603(1608)100_L]  (hidden comment: VJ0603Y104MXJCW1BC)
C16  value 100nF  [CAPC0603(1608)100_L]  (hidden comment: VJ0603Y104MXJCW1BC)
C17  value 100nF  [CAPC0603(1608)100_L]  (hidden comment: VJ0603Y104MXJCW1BC)
C18  value 100nF  [CAPC0603(1608)100_L]  (hidden comment: VJ0603Y104MXJCW1BC)
C19  value 10nF  [CAPC0603(1608)100_L]  (hidden comment: VJ0603Y103KXAAC)
C25  value 100nF  [CAPC0603(1608)100_L]  (hidden comment: VJ0603Y104MXJCW1BC)
C26  value 100nF  [CAPC0603(1608)100_L]  (hidden comment: VJ0603Y104MXJCW1BC)
C27  value 100nF  [CAPC0603(1608)100_L]  (hidden comment: VJ0603Y104MXJCW1BC)
C28  value 100nF  [CAPC0603(1608)100_L]  (hidden comment: VJ0603Y104MXJCW1BC)
CLK  TPAD6R  [TP06R]  (value not drawn)  (no BOM)
CS  TPAD6R  [TP06R]  (value not drawn)  (no BOM)
DI  TPAD6R  [TP06R]  (value not drawn)  (no BOM)
DISP1  0.96” Display Module  [New footprint 1]
DO  TPAD6R  [TP06R]  (value not drawn)  (no BOM)
DT  TPAD6R  [TP06R]  (value not drawn)  (no BOM)
INT1  TPAD6R  [TP06R]  (value not drawn)  (no BOM)
INT2  TPAD6R  [TP06R]  (value not drawn)  (no BOM)
J1  MikroBus Connector  [New footprint 1]  (no BOM)
J2  MikroBus Connector  [New footprint 1]  (no BOM)
PWM1  TPAD6R  [TP06R]  (value not drawn)  (no BOM)
PWM2  TPAD6R  [TP06R]  (value not drawn)  (no BOM)
R2  value 10k  [RESC0603(1608)_L]  (hidden comment: Resistor 10k +/-1% 0603 100 mW)
R18  value 10k  [RESC0603(1608)_L]  (hidden comment: Resistor 10k +/-1% 0603 100 mW)
R26  value 10k  [RESC0603(1608)_L]  (hidden comment: Resistor 10k +/-1% 0603 100 mW)
RST1  TPAD6R  [TP06R]  (value not drawn)  (no BOM)
RST2  TPAD6R  [TP06R]  (value not drawn)  (no BOM)
RX1  TPAD6R  [TP06R]  (value not drawn)  (no BOM)
RX2  TPAD6R  [TP06R]  (value not drawn)  (no BOM)
SKT1  5033981892  [MOLX-5033981892_V]
TX1  TPAD6R  [TP06R]  (value not drawn)  (no BOM)
TX2  TPAD6R  [TP06R]  (value not drawn)  (no BOM)

### Blocks framed on the sheet
MikroBus connectors: AN1 AN2 C25-C28 INT1 INT2 J1 J2 PWM1 PWM2 RST1 RST2 RX1 RX2 TX1 TX2
Micro SDCard Connector: C15 C16 C19 CLK CS DI DO DT R2 R18 R26 SKT1
External LCD Connector: C17 C18 DISP1

### Ports
LCDCon (harness LCDHarn, see [3] TopLevel[7B]), MicroSD (harness MicroSDHarn, see [3] TopLevel[6B]), MikroBus1Con (harness MB1Harn, see [3] TopLevel[6B]), MikroBus2Con (harness MB2Harn, see [3] TopLevel[7B])

### Harnesses
MicroSDHarn: CLK, CMD/DI, DAT0/DO, CD/DAT3/CS, DAT1, DAT2, DET_SW
LCDHarn: SCL, SDA
MB1Harn: ADC, RST, CS, SCK, MISO, MOSI, PWM, INT, RX, TX, SCL, SDA
MB2Harn: ADC, RST, CS, SCK, MISO, MOSI, PWM, INT, RX, TX, SCL, SDA

### Nets
+3V3: C15.1 C16.1 C17.1 C18.1 C25.1 C26.1 C27.1 C28.1 DISP1.2(VCC) J1.7(3.3V) J2.7(3.3V) R2.2 R18.2 SKT1.4(VDD)
GND: C15.2 C16.2 C17.2 C18.2 C19.1 C25.2 C26.2 C27.2 C28.2 DISP1.1(GND) J1.8(GND) J1.9(GND) J2.8(GND) J2.9(GND) SKT1.6(GND) SKT1.10(CD_B) SKT1.11(SHLD) SKT1.12(SHLD) SKT1.13(SHLD) SKT1.14(SHLD)
CLK: CLK.1(TP) SKT1.5(CLK) ; port MicroSD.CLK
CS: CS.1(TP) R2.1 SKT1.2(CD/DAT3) ; port MicroSD.CD/DAT3/CS
DET_SW: C19.2 DT.1(TP) R26.1 ; port MicroSD.DET_SW
DI: DI.1(TP) SKT1.3(CMD) ; port MicroSD.CMD/DI
DO: DO.1(TP) SKT1.7(DAT0) ; port MicroSD.DAT0/DO
LCD_SCL: DISP1.3(SCL) J1.12(SCL) J2.12(SCL) ; port LCDCon.SCL, port MikroBus1Con.SCL, port MikroBus2Con.SCL  [also labelled MB1_SCL, MB2_SCL]  [project net GP5/I2C0_SCL]
LCD_SDA: DISP1.4(SDA) J1.11(SDA) J2.11(SDA) ; port LCDCon.SDA, port MikroBus1Con.SDA, port MikroBus2Con.SDA  [also labelled MB1_SDA, MB2_SDA]  [project net GP4/I2C0_SDA]
MB1_ADC: AN1.1(TP) J1.1(AN) ; port MikroBus1Con.ADC  [project net GP26/MB1_ADC]
MB1_CS: J1.3(CS) ; port MikroBus1Con.CS  [project net GP14/MB1_CS]
MB1_INT: INT1.1(TP) J1.15(INT) ; port MikroBus1Con.INT  [project net GP3/MB1_INT]
MB1_MISO: J1.5(MISO) J2.5(MISO) ; port MikroBus1Con.MISO, port MikroBus2Con.MISO  [also labelled MB2_MISO]
MB1_MOSI: J1.6(MOSI) J2.6(MOSI) ; port MikroBus1Con.MOSI, port MikroBus2Con.MOSI  [also labelled MB2_MOSI]
MB1_PWM: J1.16(PWM) PWM1.1(TP) ; port MikroBus1Con.PWM  [project net GP2/MB1_PWM]
MB1_RST: J1.2(RST) RST1.1(TP) ; port MikroBus1Con.RST  [project net GP6/MB1_RST]
MB1_RX: J1.14(RX) RX1.1(TP) ; port MikroBus1Con.RX  [project net GP1/MB1_RX]
MB1_SCK: J1.4(SCK) J2.4(SCK) ; port MikroBus1Con.SCK, port MikroBus2Con.SCK  [also labelled MB2_SCK]  [project net GP18/SPI0_SCK]
MB1_TX: J1.13(TX) TX1.1(TP) ; port MikroBus1Con.TX  [project net GP0/MB1_TX]
MB2_ADC: AN2.1(TP) J2.1(AN) ; port MikroBus2Con.ADC  [project net GP27/MB2_ADC]
MB2_CS: J2.3(CS) ; port MikroBus2Con.CS  [project net GP22/MB2_CS]
MB2_INT: INT2.1(TP) J2.15(INT) ; port MikroBus2Con.INT  [project net GP21/MB2_INT]
MB2_PWM: J2.16(PWM) PWM2.1(TP) ; port MikroBus2Con.PWM  [project net GP7/MB2_PWM]
MB2_RST: J2.2(RST) RST2.1(TP) ; port MikroBus2Con.RST  [project net GP20/MB2_RST]
MB2_RX: J2.14(RX) RX2.1(TP) ; port MikroBus2Con.RX  [project net GP9/MB2_RX]
MB2_TX: J2.13(TX) TX2.1(TP) ; port MikroBus2Con.TX  [project net GP8/MB2_TX]
NetR18_1: R18.1 R26.2 SKT1.9(CD_A)
NetSKT1_1: SKT1.1(DAT2) ; port MicroSD.DAT2
NetSKT1_8: SKT1.8(DAT1) ; port MicroSD.DAT1

Not connected (* = marked no-connect by the designer): J1 10(5V)*; J2 10(5V)*

### Layout directives
net class SDCard: CLK, CS, DET_SW, DI, DO

### Notes on the sheet
- @{"Id":"HAYRLFRI\VRLSLLGZ","ObjectType":2} micro SDCard connector operating in SPI mode.
- MikroBus connectors @{"Id":"HAYRLFRI\KWQQZTNB","ObjectType":2} and @{"Id":"HAYRLFRI\UPBWUZZF","ObjectType":2} only compatible with modules operating in 3.3V. 5V power supply pin is floating.
- @{"Id":"HAYRLFRI\GXQKFZSX","ObjectType":2} I²C Addr: 0x3C
  For most OLED LCD modules.
- REVISION
- DESCRIPTION
- DATE
- APPROVED
- ADDRESS
- PROJECT
- VERSION
- TITLE
- A3
- SIZE
- SCALE
- DOCUMENT NAME:
- DOCUMENT REVISION:
- OF
- SHEET:
- PROJECT REVISION:

### Library data of the parts
AN1 AN2 CLK CS DI DO DT INT1 INT2 PWM1 PWM2 RST1 RST2 RX1 RX2 TX1 TX2 = CMP-00028-00002-2: 0.6mm round; Pins: 1
C15-C18 C25-C28 = CMP-001-00085-1: as C20 on sheet [5] ButtonsAndLeds; Packaging: Tape and Reel; Min Operating Temperature: -55°C; Case/Package: 0603; Length: 1.6mm; Termination: SMD/SMT; Height: 0.95mm; Mounting Technology: Surface Mount; Width: 0.8mm; Case Code (Imperial): 0603; Construction: Flat; Lead Free: Lead Free; Package Quantity: 4000; Max Operating Temperature: 125°C; Dielectric: X7R; RoHS Compliant: Yes; Depth: 0.8mm; Tolerance: 20%; Series: VJ; Case Code (Metric): 1608; Voltage Rating (DC): 16V
C19 = CMP-001-00084-1: as C1 on sheet [5] ButtonsAndLeds; Height: 0.92mm; Voltage Rating (DC): 50V; Depth: 0.8mm; Case Code (Imperial): 0603; Packaging: Tape and Reel; Length: 1.6mm; Max Operating Temperature: 125°C; Min Operating Temperature: -55°C; Case/Package: 0603; Pins: 2; Series: VJ; Thickness: 0.036inch; Weight: 7.1E-05oz; Reach SVHC Compliant: Unknown; Termination: SMD/SMT; Package Quantity: 1; RoHS Compliant: Yes; Mounting Technology: Surface Mount; Construction: Flat; Voltage: 50V; Lead Free: Lead Free; Width: 0.031inch; Case Code (Metric): 1608; Tolerance: 10%; Dielectric: X7R
DISP1 = CMP-003-00030-5: 0.96 Inch I2C OLED Display Module
J1 J2 = CMP-002-00071-3: MikroBus shield pico
R2 R18 R26 = CMP-009-00017-7: as R22 on sheet [3] TopLevel; RoHS Compliant: True; Min Operating Temperature: -55°C; Pins: 2; Case/Package: 0603; Mounting Technology: SM; Max Operating Temperature: 155°C; Tolerance: 1%
SKT1 = CMP-002-00049-5: Micro SD Card Connector, Pitch 1.1 mm, 8 Position, Height 1.4 mm, -25 to 85 degC, RoHS, Tape and Reel; Pins: 14

## Sheet [4] Sensors.SchDoc: =DocumentName
size A3; ENG_APP_DATE: --/--/--; DSN_APP_DATE: --/--/--; CHK_APP_DATE: --/--/--; Organization: ORGANIZATION; Address1: R. Aprígio Veloso, 882, Universitário; Address2: Campina Grande - PB; Address3: 58429-900; DocumentNumber: 4; Revision: -; SheetNumber: 4; SheetTotal: 9; Project: DemetrioGurgel - PCEIoT.PrjPcb; ENG_DATE: --/--/--; DSN_DATE: --/--/--; CHK_DATE: --/--/--; SCH_SCALE: 1:1
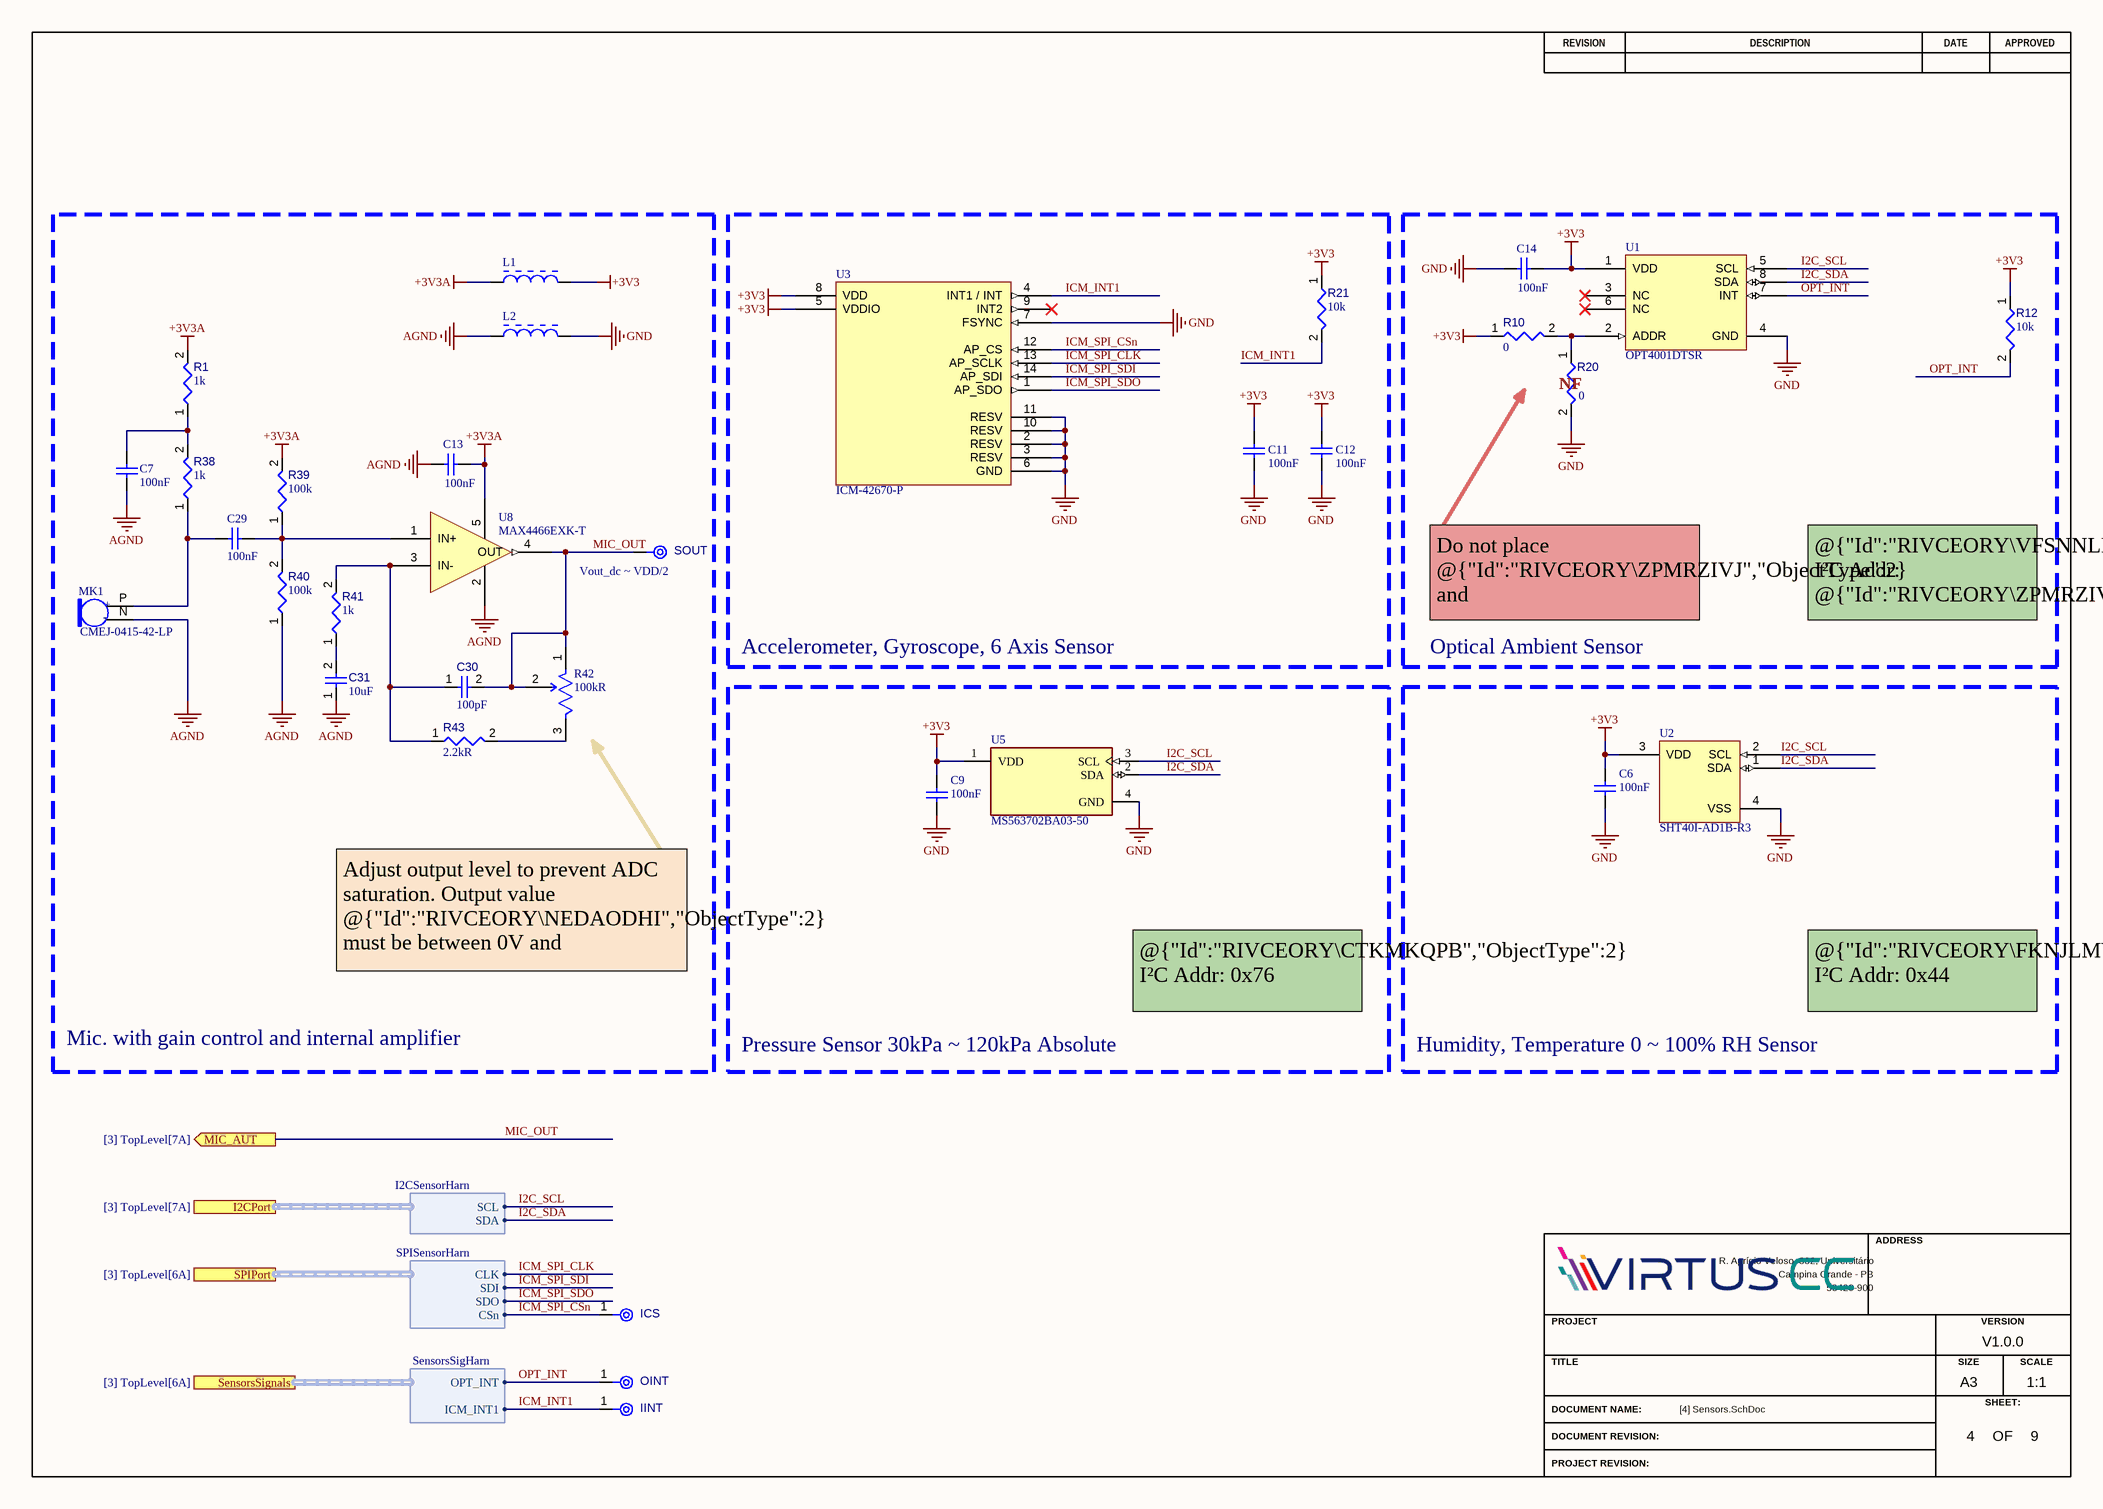
[diagram p4: [4] Sensors.SchDoc]

### Parts
C6  value 100nF  [CAPC0603(1608)100_L]  (hidden comment: VJ0603Y104MXJCW1BC)
C7  value 100nF  [CAPC0603(1608)100_L]  (hidden comment: VJ0603Y104MXJCW1BC)
C9  value 100nF  [CAPC0603(1608)100_L]  (hidden comment: VJ0603Y104MXJCW1BC)
C11  value 100nF  [CAPC0603(1608)100_L]  (hidden comment: VJ0603Y104MXJCW1BC)
C12  value 100nF  [CAPC0603(1608)100_L]  (hidden comment: VJ0603Y104MXJCW1BC)
C13  value 100nF  [CAPC0603(1608)100_L]  (hidden comment: VJ0603Y104MXJCW1BC)
C14  value 100nF  [CAPC0603(1608)100_L]  (hidden comment: VJ0603Y104MXJCW1BC)
C29  value 100nF  [CAPC0603(1608)100_L]  (hidden comment: VJ0603Y104MXJCW1BC)
C30  value 100pF  [CAPC0603(1608)100_L]  (hidden comment: C0603C101K5GACTU)
C31  value 10uF  [CAPC0603(1608)100_L]  (hidden comment: GRM188R60J106ME47D)
ICS  TPAD6R  [TP06R]  (value not drawn)  (no BOM)
IINT  TPAD6R  [TP06R]  (value not drawn)  (no BOM)
L1  BLM21PG331SN1D  [INDC2013X105X50ML20T20]  (value not drawn)
L2  BLM21PG331SN1D  [INDC2013X105X50ML20T20]  (value not drawn)
MK1  CMEJ-0415-42-LP  [MIC_CMEJ-0415-42-LP]
OINT  TPAD6R  [TP06R]  (value not drawn)  (no BOM)
R1  value 1k  [RESC0603(1608)_L]  (hidden comment: Resistor 1k +/-1% 0603 100 mW)
R10  value 0  [RESC0603(1608)_L]  (hidden comment: Resistor 0R +/- 5% 0603 100 mW)
R12  value 10k  [RESC0603(1608)_L]  (hidden comment: Resistor 10k +/-1% 0603 100 mW)
R20  value 0  [RESC0603(1608)_L]  (hidden comment: Resistor 0R +/- 5% 0603 100 mW)
R21  value 10k  [RESC0603(1608)_L]  (hidden comment: Resistor 10k +/-1% 0603 100 mW)
R38  value 1k  [RESC0603(1608)_L]  (hidden comment: Resistor 1k +/-1% 0603 100 mW)
R39  value 100k  [RESC0603(1608)_L]  (hidden comment: Resistor 100k +/-1% 0603 100 mW)
R40  value 100k  [RESC0603(1608)_L]  (hidden comment: Resistor 100k +/-1% 0603 100 mW)
R41  value 1k  [RESC0603(1608)_L]  (hidden comment: Resistor 1k +/-1% 0603 100 mW)
R42  value 100kR  [FP-TC33X-2-MFG]  (hidden comment: TC33X-2-104E)
R43  value 2.2kR  [RESC0603(1608)_L]  (hidden comment: CRCW06032K20FKEA)
SOUT  TPAD6R  [TP06R]  (value not drawn)  (no BOM)
U1  OPT4001DTSR  [SON50P130X60-8N]
U2  SHT40I-AD1B-R3  [QFN80P150X150X55-4N]
U3  ICM-42670-P  [QFN50P300X250X81-14N]
U5  MS563702BA03-50  [FP-MS563702BA03-50-MFG]
U8  MAX4466EXK-T  [SOT65P200X110-5N]

### Blocks framed on the sheet
Mic. with gain control and internal amplifier: C7 C13 C29-C31 L1 L2 MK1 R1 R38-R43 SOUT U8
Accelerometer, Gyroscope, 6 Axis Sensor: C11 C12 R21 U3
Optical Ambient Sensor: C14 R10 R12 R20 U1
Pressure Sensor 30kPa ~ 120kPa Absolute: C9 U5
Humidity, Temperature 0 ~ 100% RH Sensor: C6 U2

### Ports
I2CPort (harness I2CSensorHarn, see [3] TopLevel[7A]), MIC_AUT (out, see [3] TopLevel[7A]), SensorsSignals (harness SensorsSigHarn, see [3] TopLevel[6A]), SPIPort (harness SPISensorHarn, see [3] TopLevel[6A])

### Harnesses
I2CSensorHarn: SCL, SDA
SPISensorHarn: CLK, SDI, SDO, CSn
SensorsSigHarn: OPT_INT, ICM_INT1

### Nets
+3V3: C6.1 C9.1 C11.2 C12.2 C14.1 L1.2 R10.1 R12.1 R21.1 U1.1(VDD) U2.3(VDD) U3.5(VDDIO) U3.8(VDD) U5.1(VDD)
+3V3A: C13.1 L1.1 R1.2 R39.2 U8.5(VCC)
AGND: C7.1 C13.2 C31.1 L2.1 MK1.N(GND) R40.1 U8.2(GND)
GND: C6.2 C9.2 C11.1 C12.1 C14.2 L2.2 R20.2 U1.4(GND) U2.4(VSS) U3.2(RESV) U3.3(RESV) U3.6(GND) U3.7(FSYNC) U3.10(RESV) U3.11(RESV) U5.4(GND)
I2C_SCL: U1.5(SCL) U2.2(SCL) U5.3(SCL) ; port I2CPort.SCL  [project net GP5/I2C0_SCL]
I2C_SDA: U1.8(SDA) U2.1(SDA) U5.2(SDA) ; port I2CPort.SDA  [project net GP4/I2C0_SDA]
ICM_INT1: IINT.1(TP) R21.2 U3.4(INT1_/_INT) ; port SensorsSignals.ICM_INT1  [project net GP12/ICM_INT1]
ICM_SPI_CLK: U3.13(AP_SCLK) ; port SPIPort.CLK  [project net GP18/SPI0_SCK]
ICM_SPI_CSn: ICS.1(TP) U3.12(AP_CS) ; port SPIPort.CSn  [project net GP10/MOT_CSn]
ICM_SPI_SDI: U3.14(AP_SDI) ; port SPIPort.SDI  [project net GP19/SPI0_TX]
ICM_SPI_SDO: U3.1(AP_SDO) ; port SPIPort.SDO  [project net GP16/SPI0_RX]
MIC_OUT: C30.2 R42.1(CCW) R42.2(WIPER) SOUT.1(TP) U8.4(OUT) ; port MIC_AUT
OPT_INT: OINT.1(TP) R12.2 U1.7(INT) ; port SensorsSignals.OPT_INT  [project net GP13/OPT_INT]
NetC7_2: C7.2 R1.1 R38.2
NetC29_1: C29.1 R39.1 R40.2 U8.1(IN+)
NetC29_2: C29.2 MK1.P(OUTPUT) R38.1
NetC30_1: C30.1 R41.2 R43.1 U8.3(IN-)
NetC31_2: C31.2 R41.1
NetR10_2: R10.2 R20.1 U1.2(ADDR)
NetR42_3: R42.3(CW) R43.2

Not connected (* = marked no-connect by the designer): U1 3(NC)* 6(NC)*; U3 9(INT2)*

### Notes on the sheet
- (near R20) NF
- (near SOUT) Vout_dc ~ VDD/2
- Do not place @{"Id":"RIVCEORY\ZPMRZIVJ","ObjectType":2} and @{"Id":"RIVCEORY\HHRDZMEH","ObjectType":2} simultaneously.
- @{"Id":"RIVCEORY\VFSNNLBI","ObjectType":2}  I²C Addr:
  @{"Id":"RIVCEORY\ZPMRZIVJ","ObjectType":2} placed:  0x45
  @{"Id":"RIVCEORY\HHRDZMEH","ObjectType":2} placed: 0x44
- Adjust output level to prevent ADC saturation. Output value @{"Id":"RIVCEORY\NEDAODHI","ObjectType":2} must be between 0V and @{"Id":"UWLTDAZK\QMLQKOEH","ObjectType":1} (2.5V according with @{"Id":"ZKKBHFZM\SRYFMNCR","ObjectType":2}).
- @{"Id":"RIVCEORY\CTKMKQPB","ObjectType":2} I²C Addr: 0x76
- @{"Id":"RIVCEORY\FKNJLMYU","ObjectType":2} I²C Addr: 0x44
- REVISION
- DESCRIPTION
- DATE
- APPROVED
- ADDRESS
- PROJECT
- VERSION
- TITLE
- A3
- SIZE
- SCALE
- DOCUMENT NAME:
- DOCUMENT REVISION:
- OF
- SHEET:
- PROJECT REVISION:
- (in symbol CMP-010-000001-2) +; -

### Library data of the parts
C6 C7 C9 C11-C14 C29 = CMP-001-00085-1: as C20 on sheet [5] ButtonsAndLeds; Packaging: Tape and Reel; Min Operating Temperature: -55°C; Case/Package: 0603; Length: 1.6mm; Termination: SMD/SMT; Height: 0.95mm; Mounting Technology: Surface Mount; Width: 0.8mm; Case Code (Imperial): 0603; Construction: Flat; Lead Free: Lead Free; Package Quantity: 4000; Max Operating Temperature: 125°C; Dielectric: X7R; RoHS Compliant: Yes; Depth: 0.8mm; Tolerance: 20%; Series: VJ; Case Code (Metric): 1608; Voltage Rating (DC): 16V
C30 = CMP-001-00088-1: Multilayer Ceramic Capacitor, 100 pF, 50 V, ï¿½ 10%, C0G (NP0), 0603 [1608 Metric]; Dissipation Factor: 0.1%; Voltage Rating: 50V; Temperature Coefficient: 30ppm/°C; Min Operating Temperature: -55°C; Dielectric Material: Ceramic; Case/Package: 0603; Depth: 0.8mm; Mounting Technology: Surface Mount,PCB; Tolerance: 10%; Dielectric: C0G; Case Code (Metric): 1608; Height: 0.8mm; RoHS Compliant: Yes; Termination: SMD/SMT; Max Operating Temperature: 125°C; Length: 1.6mm; Packaging: Tape and Reel; Radiation Hardening: No; Voltage Rating (DC): 50V; Package Quantity: 1; Lead Free: Lead Free; Construction: Flat; Lead Pitch: 0.7mm; Series: C; Thickness: 0.034inch; Reach SVHC Compliant: No; Width: 0.031inch; Material: Ceramic; Case Code (Imperial): 0603
C31 = CMP-001-00087-1: Multilayer Ceramic Capacitor, 10 uF, 6.3 V, ± 20%, X5R, 0603 [1608 Metric]; Voltage Rating: 6.3V; Case/Package: 0603; Series: GRM; Mounting Technology: Surface Mount; RoHS Compliant: Yes; Package Quantity: 4000; Case Code (Metric): 1608; Dielectric: X5R; Weight: 0.000222oz; Max Operating Temperature: 85°C; Width: 0.8mm; Termination: Standard; Height: 0.8mm; Tolerance: 20%; Voltage Rating (DC): 6.3V; Length: 1.6mm; Min Operating Temperature: -55°C; Packaging: Cut Tape; Lead Free: Lead Free; Case Code (Imperial): 0603
ICS IINT OINT SOUT = CMP-00028-00002-2: 0.6mm round; Pins: 1
L1 L2 = CMP-006-00000-4: IND, Chip Ferrite Bead, 330 Ohm, +/- 25%, 1.5 A, -55 to 125 degC, 0805 (2012 Metric), Tape and Reel; Manufacturer: Murata; Current Rating: 1.5A; Impedance: 330Ohm; Resistance: 90mohm; Max Operating Temperature: 125°C; Core Material: Ferrite; Case/Package: 0805; Mounting Technology: SM; Datasheet URL: http://psearch.en.murata.com/inductor/product/LQG15HS15NJ02_.pdf; Packaging: TapeandReel; Min Operating Temperature: -55°C; RoHS Compliant: True; Max Current Rating: 1.5A; Datasheet Version: Nov-11; Package Quantity: 4000; Package Reference: 0805; Package Description: 2-Pin Surface Mount Device, Body 2 x1.25 mm; Tolerance: 25%
MK1 = CMP-010-000001-2: 4.0 mm, Omnidirectional, PCB Mount, 2.0 Vdc, Elecret Condenser Microphone; Frequency: 100Hz; Shape: Circular; Operating Supply Current: 500uA; Voltage Rating: 2V; Output Type: Analog; Clock Frequency: 10kHz; MF: {'manufacturer': u'CUI'}; Value: *; Termination: PC Pins; Availability: Unavailable; Width: 4mm; Design Item ID: CMEJ-0415-42-LP; Series: CMEJ; Direction: Omnidirectional; Pin Count: 2; Price: None; Component Type: Standard; Package: None; MP: CMEJ-0415-42-LP; Operating Supply Voltage: 2V; Length: 4mm; Height: 1.5mm; Source: CMEJ-0415-42-LP.SchLib
R1 R38 R41 = CMP-009-00014-6: as R45 on sheet [3] TopLevel; Mounting Technology: SM; Case/Package: 0603; Min Operating Temperature: -55°C; RoHS Compliant: True; Max Operating Temperature: 155°C; Pins: 2
R10 R20 = CMP-009-00006-6: as R5 on sheet [3] TopLevel; Tolerance: 5%; Mounting Technology: SM; RoHS Compliant: True; Max Operating Temperature: 155°C; Min Operating Temperature: -55°C; Case/Package: 0603; Pins: 2
R12 R21 = CMP-009-00017-7: as R22 on sheet [3] TopLevel; RoHS Compliant: True; Min Operating Temperature: -55°C; Pins: 2; Case/Package: 0603; Mounting Technology: SM; Max Operating Temperature: 155°C; Tolerance: 1%
R39 R40 = CMP-009-00023-6: Chip Resistor, 100 KOhm, +/- 1%, 0.1 W, -55 to 155 degC, 0603 (1608 Metric); Power: 100mW; Voltage Rating: 50V; Tolerance: 1%; RoHS Compliant: True; Pins: 2; Min Operating Temperature: -55°C; Case/Package: 0603; Max Operating Temperature: 155°C; Mounting Technology: SM
R42 = CMP-009-00187-1: Cermet trimmer potentiometer, 100 kΩ, 0.1 W, SMD, on top, TC33X-2-104E; Resistance Tolerance: 25%; Voltage Rating (DC): 50V; Power Rating: 100mW; Temperature Coefficient: 250ppm/°C; Number of Turns: 1; Mounting Technology: Surface Mount; Pins: 2; Resistor Type: Carbon,Cermet; Tolerance: 25%; Min Operating Temperature: -40°C; Radiation Hardening: No; Length: 0.15inch; Max Operating Temperature: 100°C; Height: 0.047inch; RoHS Compliant: Yes; Max Power Dissipation: 100mW; Depth: 3.8mm; Reach SVHC Compliant: No; Military Standard: Not; Series: TC33; Width: 0.118inch; Weight: 29.4mg; Termination: Foot Print; Package Quantity: 1; Packaging: Tape and Reel
R43 = CMP-009-00186-1: SMD Chip Resistor, 2.2 kOhm, ± 1%, 100 mW, 0603 [1608 Metric], Thick Film, General Purpose; Voltage Rating (DC): 75V; Max Power Dissipation: 100mW; Temperature Coefficient: 100ppm/°C; Depth: 0.85mm; Height: 0.45mm; Contact Plating: Tin; Resistance Tolerance: 1%; Ratings: AEC-Q200; Weight: 7.1E-05oz; Series: CRCW; Case Code (Imperial): 0603; Construction: Rectangular; Width: 0.033inch; Reach SVHC Compliant: Unknown; Case Code (Metric): 1608; Resistor Type: Thick Film; Packaging: Tape and Reel; Case/Package: 0603; Package Quantity: 10; RoHS Compliant: Yes; Lead Free: Lead Free; Military Standard: Not; Termination: SMD/SMT; Tolerance: 1%; Technology: THICK FILM; Max Operating Temperature: 155°C; Voltage Rating: 75V; Power Rating: 100mW; Length: 1.55mm; Number of Terminations: 2; Radiation Hardening: No; Min Operating Temperature: -55°C; Features: Automotive AEC-Q200
U1 = CMP-010-00031-2: High-speed high-precision digital ambient light sensor (ALS) 8-SOT-5X3 -40 to 85; Pins: 8; Height: 600um; Thickness: 550um; Length: 2.1mm; Width: 1.2mm
U2 = CMP-010-00033-3: Humidity And Temperature Sensor
U3 = CMP-010-00032-3: Mems Module, 1.71-3.6 V, Lga-14 Rohs Compliant: Yes; Min Operating Temperature: -40°C; Width: 3mm; Length: 2.5mm
U5 = CMP-010-00027-2: Pressure Sensor, Barometric, 300 mbar, 1200 mbar, QFN, 8, -40 C; Supply Current: 20.09uA; Min Supply Voltage: 1.8V; Max Supply Voltage: 3.6V; Pins: 8; Lead Free: Lead Free; Min Operating Temperature: -40°C; Pressure Type: Barometric; Height: 1mm; Max Operating Temperature: 85°C; Reach SVHC Compliant: No; RoHS Compliant: Yes; Packaging: Cut Tape; Case/Package: QFN
U8 = CMP-00027-00002-4: Audio Amp Microphone 1-CH Mono Class-AB 5-Pin SC-70 T/R; Gain Bandwidth Product: 600kHz; Max Supply Voltage: 5.5V; Min Supply Voltage: 2.4V; Power Supply Rejection Ratio (PSRR): 112dB; Mounting Technology: Surface Mount; Max Operating Temperature: 85°C; Radiation Hardening: No; RoHS Compliant: No; Packaging: Tape and Reel; Min Operating Temperature: -40°C; Series: -